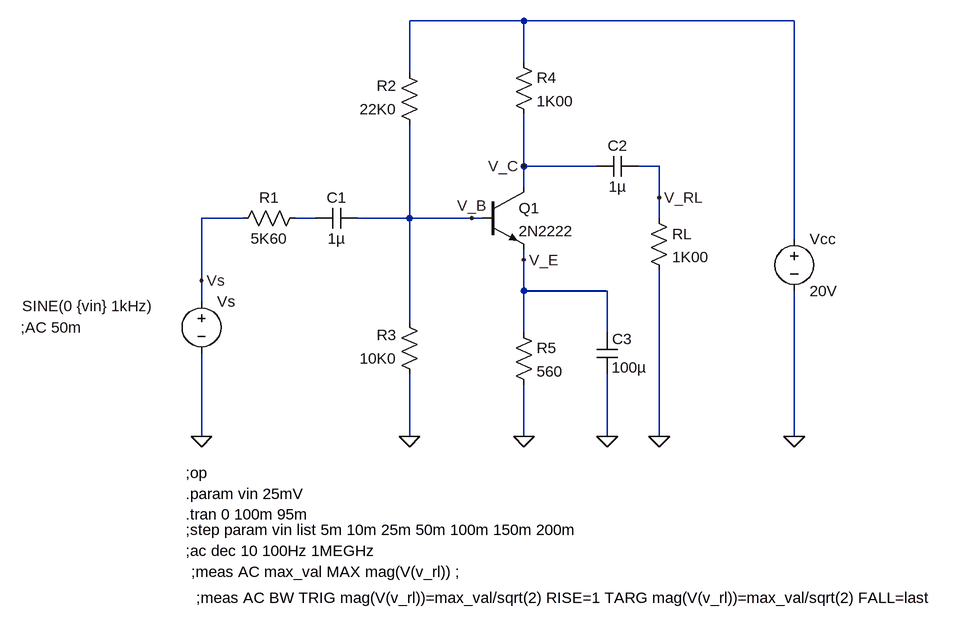
[diagram p0: schematic amplifier_circuit.asc]
amplifier_circuit.asc, the LTspice schematic file:
Version 4
SHEET 1 1196 680
WIRE 448 -336 272 -336
WIRE 864 -336 448 -336
WIRE 448 -272 448 -336
WIRE 272 -256 272 -336
WIRE 448 -112 448 -192
WIRE 560 -112 448 -112
WIRE 656 -112 624 -112
WIRE 448 -80 448 -112
WIRE 656 -64 656 -112
WIRE 16 -32 -48 -32
WIRE 128 -32 96 -32
WIRE 272 -32 272 -176
WIRE 272 -32 192 -32
WIRE 368 -32 272 -32
WIRE 384 -32 368 -32
WIRE 656 -32 656 -64
WIRE 864 0 864 -336
WIRE 448 32 448 16
WIRE -48 64 -48 -32
WIRE 448 80 448 32
WIRE 576 80 448 80
WIRE -48 96 -48 64
WIRE 272 128 272 -32
WIRE 448 144 448 80
WIRE 576 144 576 80
WIRE -48 304 -48 176
WIRE 272 304 272 208
WIRE 448 304 448 224
WIRE 576 304 576 208
WIRE 656 304 656 48
WIRE 864 304 864 80
FLAG -48 304 0
FLAG 272 304 0
FLAG 448 304 0
FLAG 576 304 0
FLAG 656 304 0
FLAG 864 304 0
FLAG 448 -112 V_C
FLAG 448 32 V_E
FLAG 368 -32 V_B
FLAG -48 64 Vs
FLAG 656 -64 V_RL
SYMBOL voltage -48 80 R0
WINDOW 3 -276 23 Left 2
WINDOW 123 -278 56 Left 2
WINDOW 39 0 0 Left 0
SYMATTR Value SINE(0 {vin} 1kHz)
SYMATTR Value2 ;AC 50m
SYMATTR InstName Vs
SYMBOL voltage 864 -16 R0
SYMATTR InstName Vcc
SYMATTR Value 20V
SYMBOL res 112 -48 R90
WINDOW 0 0 56 VBottom 2
WINDOW 3 32 56 VTop 2
SYMATTR InstName R1
SYMATTR Value 5K60
SYMBOL res 288 -160 R180
WINDOW 0 36 76 Left 2
WINDOW 3 36 40 Left 2
SYMATTR InstName R2
SYMATTR Value 22K0
SYMBOL res 288 224 R180
WINDOW 0 36 76 Left 2
WINDOW 3 36 40 Left 2
SYMATTR InstName R3
SYMATTR Value 10K0
SYMBOL res 432 -288 R0
SYMATTR InstName R4
SYMATTR Value 1K00
SYMBOL res 432 128 R0
SYMATTR InstName R5
SYMATTR Value 560
SYMBOL res 640 -48 R0
SYMATTR InstName RL
SYMATTR Value 1K00
SYMBOL cap 192 -48 R90
WINDOW 0 0 32 VBottom 2
WINDOW 3 32 32 VTop 2
SYMATTR InstName C1
SYMATTR Value 1µ
SYMBOL cap 624 -128 R90
WINDOW 0 0 32 VBottom 2
WINDOW 3 32 32 VTop 2
SYMATTR InstName C2
SYMATTR Value 1µ
SYMBOL cap 592 208 R180
WINDOW 0 -23 54 Left 2
WINDOW 3 -45 10 Left 2
SYMATTR InstName C3
SYMATTR Value 100µ
SYMBOL npn 384 -80 R0
SYMATTR InstName Q1
SYMATTR Value 2N2222
TEXT -72 360 Left 2 !;op
TEXT -72 424 Left 2 !.tran 0 100m 95m
TEXT -72 392 Left 2 !.param vin 25mV
TEXT -72 448 Left 2 !;step param vin list 5m 10m 25m 50m 100m 150m 200m
TEXT -72 480 Left 2 !;ac dec 10 100Hz 1MEGHz
TEXT -64 512 Left 2 !;meas AC max_val MAX mag(V(v_rl)) ;
TEXT -56 552 Left 2 !;meas AC BW TRIG mag(V(v_rl))=max_val/sqrt(2) RISE=1 TARG mag(V(v_rl))=max_val/sqrt(2) FALL=last

The netlist it stands for:
* amplifier_circuit.asc
Vs Vs 0 SINE(0 {vin} 1kHz) ;AC 50m
Vcc N001 0 20V
R1 N002 Vs 5K60
R2 V_B N001 22K0
R3 0 V_B 10K0
R4 N001 V_C 1K00
R5 V_E 0 560
RL V_RL 0 1K00
C1 V_B N002 1µ
C2 V_RL V_C 1µ
C3 0 V_E 100µ
Q1 V_C V_B V_E 0 2N2222
.model NPN NPN
.model PNP PNP
.lib standard.bjt
;op
.tran 0 100m 95m
.param vin 25mV
;step param vin list 5m 10m 25m 50m 100m 150m 200m
;ac dec 10 100Hz 1MEGHz
;meas AC max_val MAX mag(V(v_rl)) ;
;meas AC BW TRIG mag(V(v_rl))=max_val/sqrt(2) RISE=1 TARG mag(V(v_rl))=max_val/sqrt(2) FALL=last
.backanno
.end